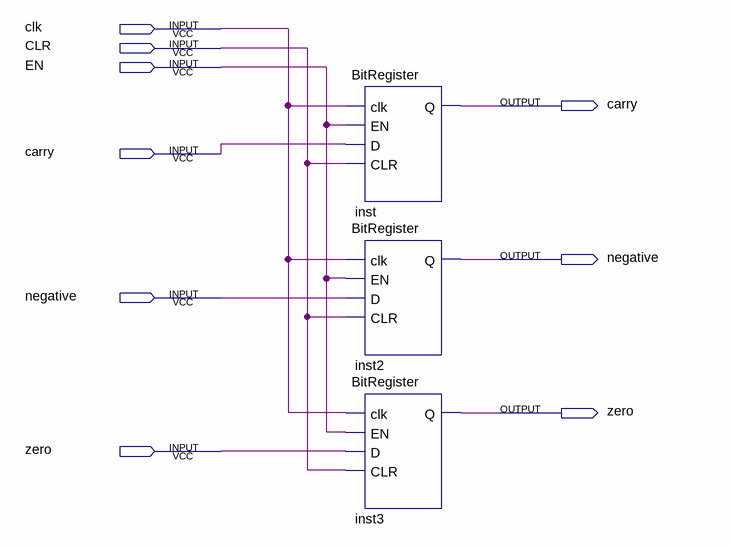
[diagram p0: schematic sheet]
// Quartus schematic FlagRegisters.bdf as structural Verilog: 3 symbols, 9 pins
module FlagRegisters (
  input  clk,
  input  CLR,
  input  EN,
  inout  carry,
  inout  negative,
  inout  zero
);

  BitRegister inst (.clk(clk), .EN(EN), .D(carry), .CLR(CLR), .Q(carry));
  BitRegister inst2 (.clk(clk), .EN(EN), .D(negative), .CLR(CLR), .Q(negative));
  BitRegister inst3 (.clk(clk), .EN(EN), .D(zero), .CLR(CLR), .Q(zero));
endmodule
